# EAGLE schematic Vinduino-H V0.2 (EAGLE 7.1.0)
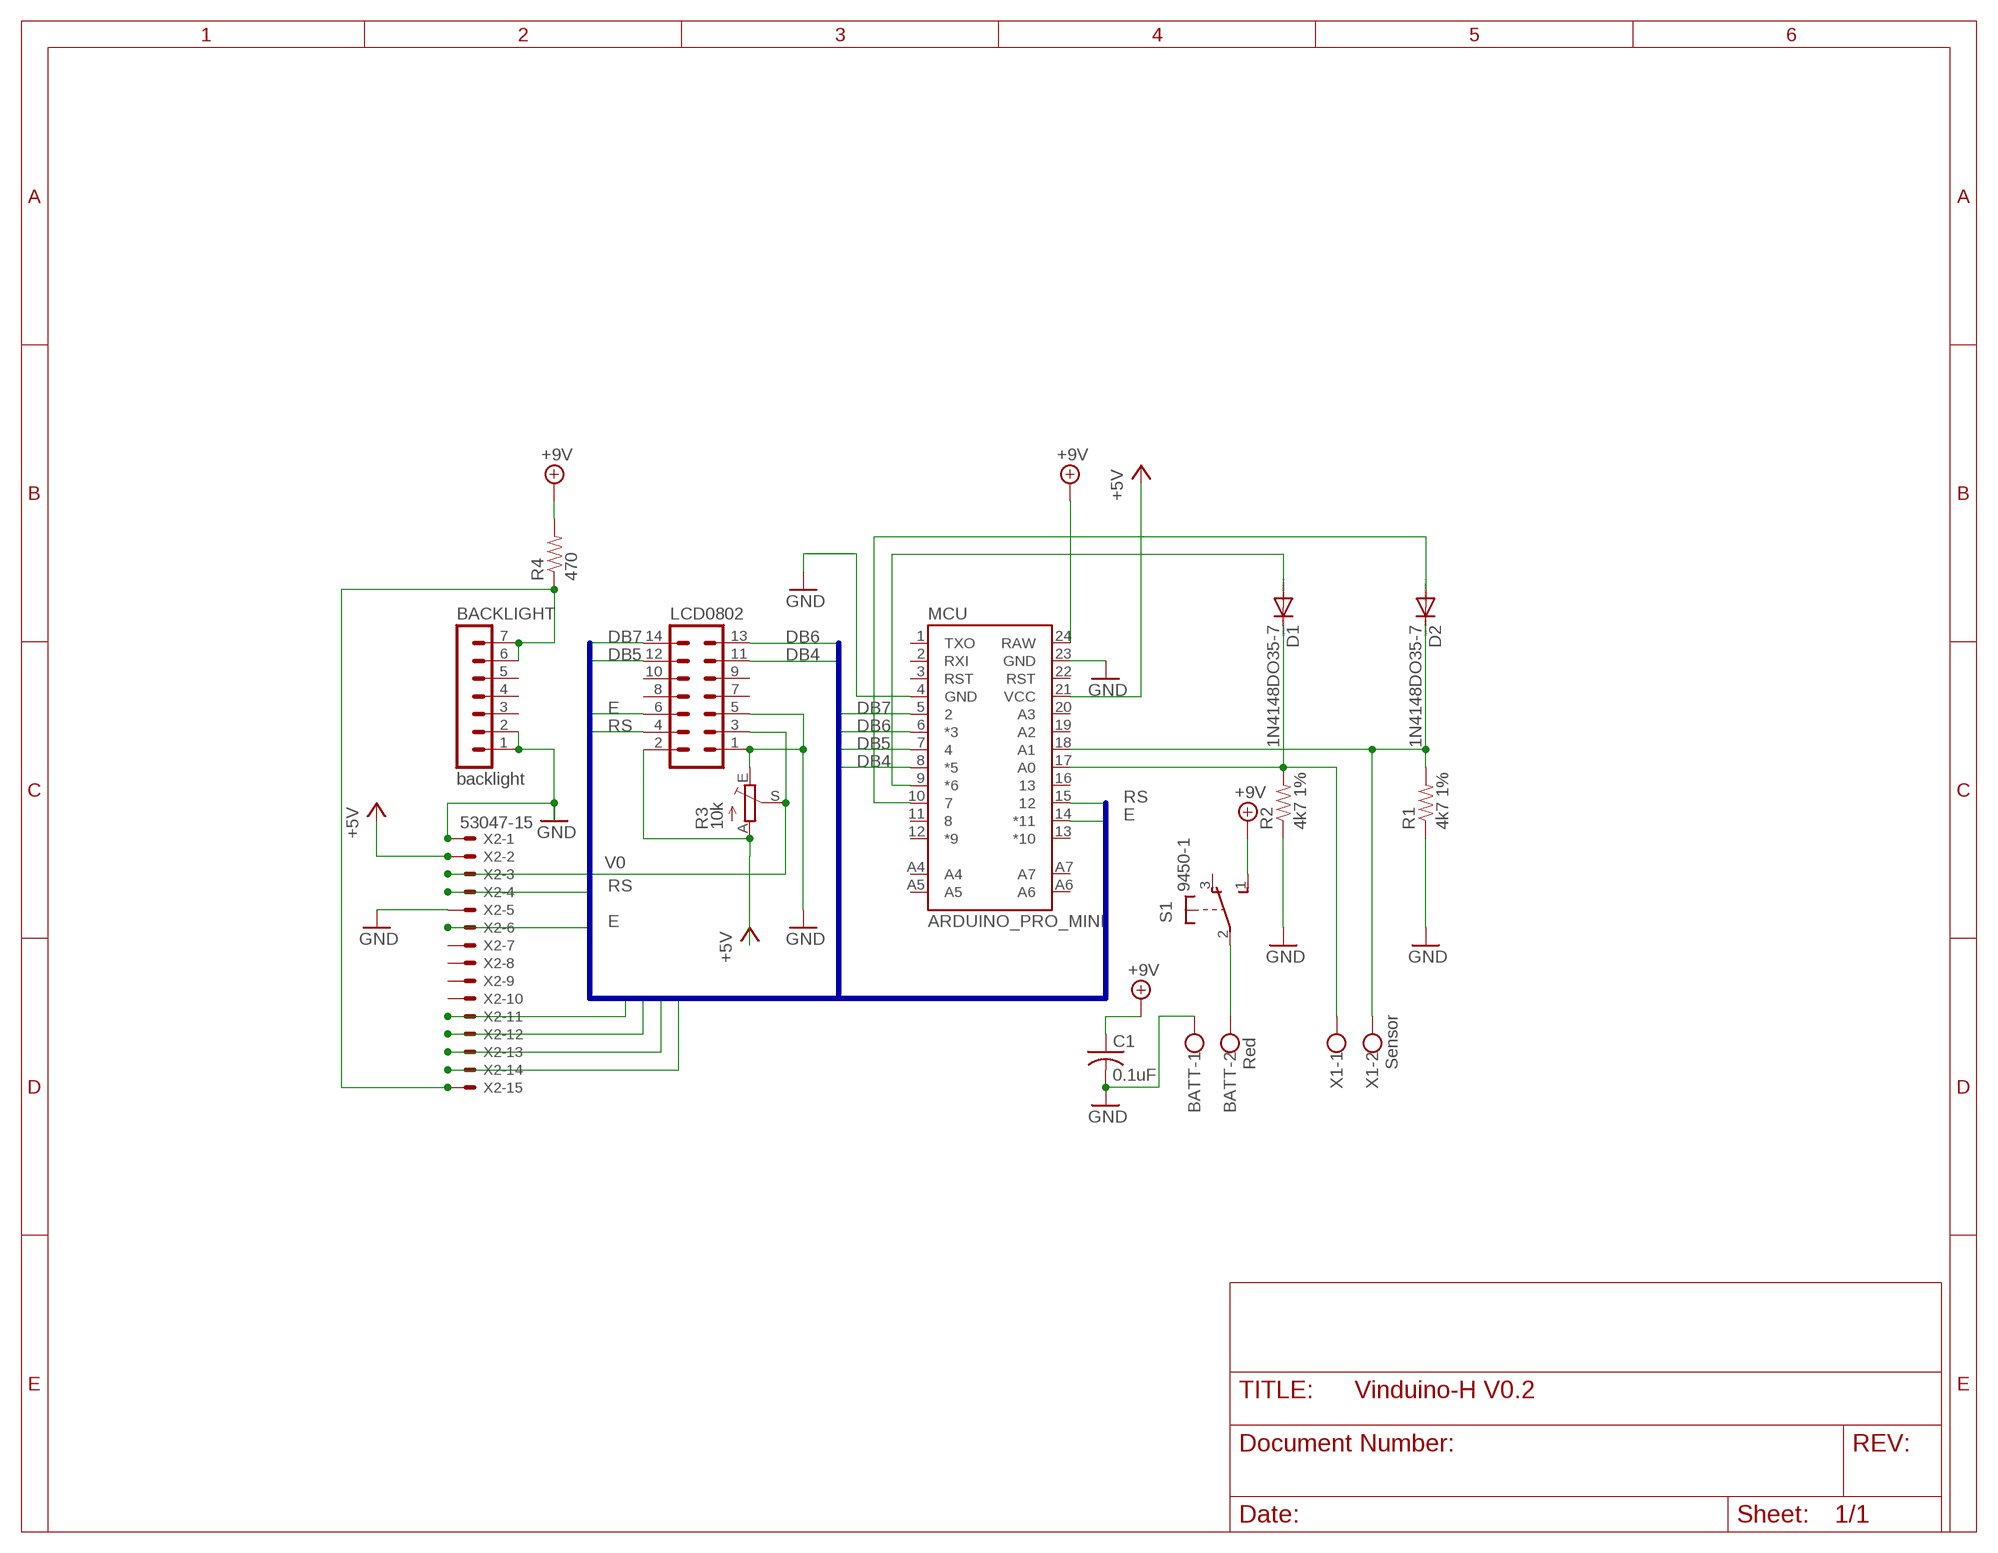
[diagram p0: schematic, sheet 1]

## Parts
BACKLIGHT  backlight  MA07-1  [MA07-1]
BATT  Red  W237-102  [W237-102]
C1  0.1uF  C-USC1210K  [C1210K]
D1  1N4148DO35-7  [DO35-7]
D2  1N4148DO35-7  [DO35-7]
LCD0802  MA07-2  [MA07-2]
MCU  ARDUINO_PRO_MINI  [ARDUINO_PRO_MINI]
R1  4k7 1%  RESISTORPTH-1/2W  [AXIAL-0.5]
R2  4k7 1%  RESISTORPTH-1/2W  [AXIAL-0.5]
R3  10k  TRIM_EU-RJ9W  [RJ9W]
R4  470  RESISTORPTH-1/2W  [AXIAL-0.5]
S1  9450-1  [9450-1]
X1  Sensor  W237-102  [W237-102]
X2  53047-15  [53047-15]

## Nets
+5V: LCD0802.2 MCU.21(VCC) R3.A X2.2
+9V: C1.1 MCU.24(RAW) R4.P$2 S1.1(S)
DB4: LCD0802.11 MCU.8(*5) X2.11
DB5: LCD0802.12 MCU.7 X2.12
DB6: LCD0802.13 MCU.6(*3) X2.13
DB7: LCD0802.14 MCU.5 X2.14
E: LCD0802.6 MCU.14(*11) X2.6
GND: BACKLIGHT.1 BACKLIGHT.2 BATT.1 C1.2 LCD0802.1 LCD0802.5 MCU.4(GND) MCU.23(GND) R1.P$1 R2.P$1 R3.E X2.1 X2.5
N$1: D1.C MCU.17(A0) R2.P$2 X1.1
N$2: BACKLIGHT.6 BACKLIGHT.7 R4.P$1 X2.15
N$3: D1.A MCU.9(*6)
N$4: D2.A MCU.10
N$5: BATT.2 S1.2(P)
N$7: D2.C MCU.18(A1) R1.P$2 X1.2
RS: LCD0802.4 MCU.15 X2.4
V0: LCD0802.3 R3.S X2.3
Unconnected: BACKLIGHT.3 BACKLIGHT.4 BACKLIGHT.5 LCD0802.7 LCD0802.8 LCD0802.9 LCD0802.10 MCU.1(TXO) MCU.2(RXI) MCU.3(RST) MCU.11 MCU.12(*9) MCU.13(*10) MCU.16 MCU.19(A2) MCU.20(A3) MCU.22(RST) MCU.A4 MCU.A5 MCU.A6 MCU.A7 S1.3(O) X2.7 X2.8 X2.9 X2.10

## Buses
LCD_BUS:DB[4..7],E,RW,RS

## Library data of the parts
BACKLIGHT = con-lstb:MA07-1: PIN HEADER; OC_FARNELL: unknown; OC_NEWARK: unknown
BATT X1 = con-wago-500:W237-102: WAGO SCREW CLAMP; MPN: 237-102; OC_FARNELL: unknown; OC_NEWARK: 70K9898
C1 = adafruit:C-US: CAPACITOR, American symbol
D1 D2 = diode:1N4148: DIODE high speed (Philips)
LCD0802 = con-lstb:MA07-2: PIN HEADER; OC_FARNELL: unknown; OC_NEWARK: unknown
MCU = SparkFun-Boards:ARDUINO_PRO_MINI
R1 R2 R4 = SparkFun-Resistors:RESISTOR: Resistor Basic schematic elements and footprints for 0603, 1206, and PTH resistors.
R3 = pot:TRIM_EU-: POTENTIOMETER
S1 = switch-misc:9450-1: MARQUARDT SWITCH
X2 = con-molex:53?-15: CONNECTOR wire to board 1.25 mm (.049 inch) pitch header; MPN: 53047-1510-C; OC_FARNELL: unknown; OC_NEWARK: 79K4146

## Net classes
0 default: width 0.254 mm, clearance 0.254 mm
1 Supply: width 0.508 mm, clearance 0.508 mm